# EAGLE design bootloader_example (EAGLE 5.10)
JAMECO: 100803, 4x100766
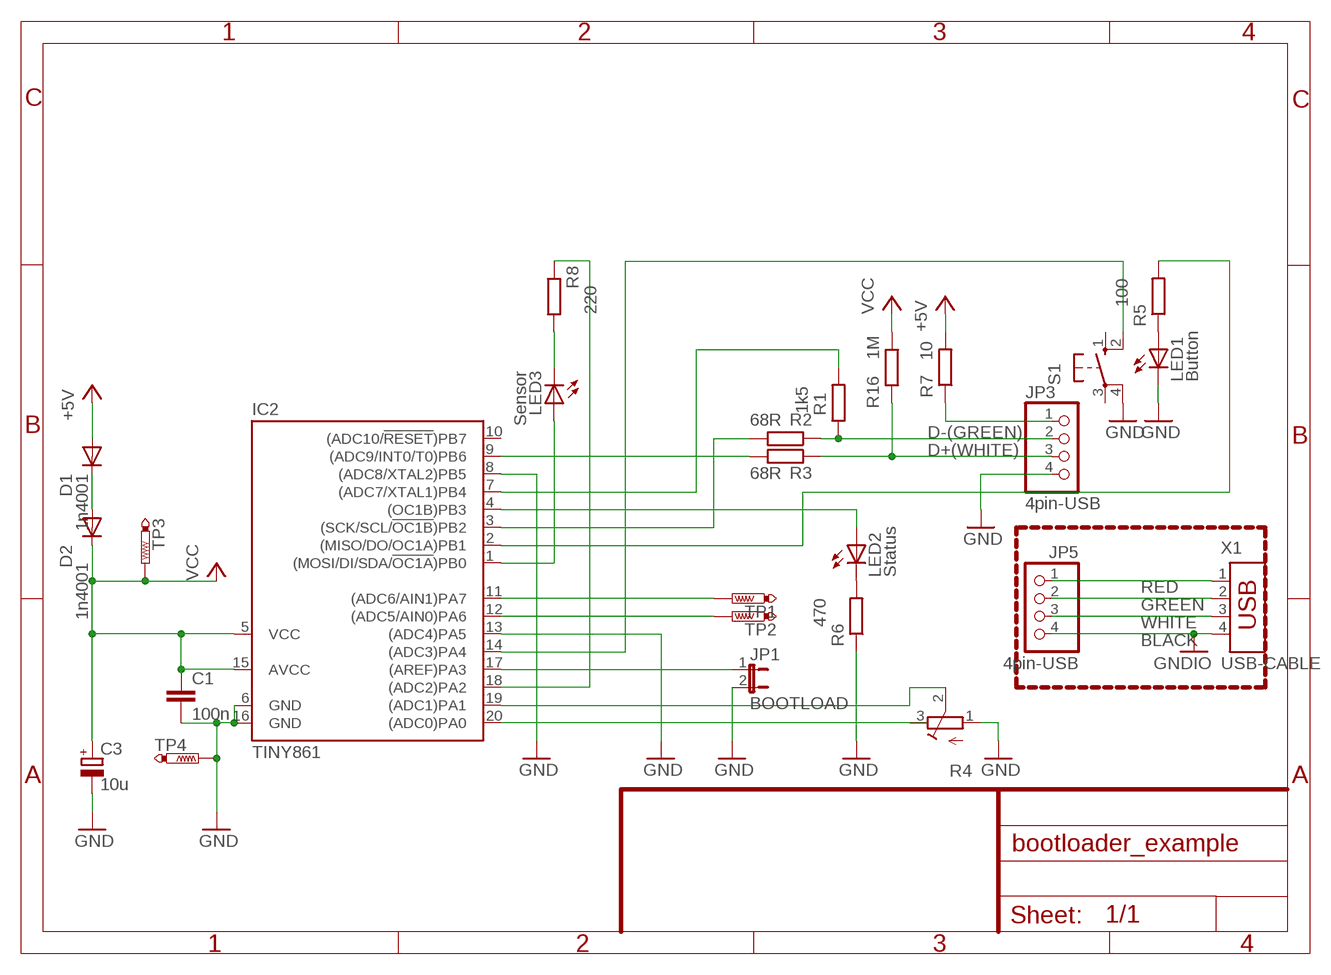
[diagram p0: schematic, sheet 1]

## Parts
C1  100n  C-EU050-030X075  [C050-030X075]
C3  10u  CPOL-EUE2.5-5  [E2,5-5]
D1  1n4001  1N4148DO35-7  [DO35-7]
D2  1n4001  1N4148DO35-7  [DO35-7]
IC2  TINY861  TINY26LP  [DIL20]
JP1  BOOTLOAD  JP1E  [JP1]
JP3  4pin-USB  PINHD-1X4  [1X04]
JP5  4pin-USB  PINHD-1X4  [1X04]
LED1  Button  LED3MM  [LED3MM]
LED2  Status  LED3MM  [LED3MM]
LED3  Sensor  LED3MM  [LED3MM]
R1  1k5  R-EU_0204/7  [0204/7]
R2  68R  R-EU_0207/2V  [0207/2V]
R3  68R  R-EU_0207/2V  [0207/2V]
R4  R-TRIMM64Y  [RTRIM64Y]
R5  100  R-EU_0207/10  [0207/10]
R6  470  R-EU_0204/5  [0204/5]
R7  10  R-EU_0207/2V  [0207/2V]
R8  220  R-EU_0204/2V  [0204V]
R16  1M  R-EU_0207/10  [0207/10]
S1  10-XX  [B3F-10XX]
TP1  PTR1PAD1-13  [P1-13]
TP2  PTR1PAD1-13  [P1-13]
TP3  PTR1PAD1-13  [P1-13]
TP4  PTR1PAD1-13  [P1-13]
X1  USB-CABLE  USB-787616  [USB]

## Nets
+4.4V: D1.C D2.A
+5V: D1.A R7.2
BLACK: JP5.4 X1.4 ; supply symbol labelled GNDIO
D+(WHITE): JP3.3 R3.1 R16.2
D-(GREEN): JP3.2 R1.1 R2.1
GND: C1.2 C3.- IC2.6(GND) IC2.8((ADC8/XTAL2)PB5) IC2.13((ADC4)PA5) IC2.16(GND) JP1.2 JP3.4 LED1.K(C) R4.1(E) R6.1 S1.4(P1) TP4.TP
GREEN: JP5.2 X1.2
N$1: IC2.19((ADC1)PA1) R4.2(S)
N$2: IC2.17((AREF)PA3) JP1.1
N$3: LED2.K(C) R6.2
N$4: IC2.4((OC1B)PB3) LED2.A
N$5: IC2.20((ADC0)PA0) R4.3(A)
N$6: IC2.14((ADC3)PA4) S1.2(S1)
N$7: LED1.A R5.1
N$8: IC2.2((MISO/DO/OC1A)PB1) R5.2
N$9: IC2.11((ADC6/AIN1)PA7) TP1.TP
N$10: IC2.12((ADC5/AIN0)PA6) TP2.TP
N$11: LED3.K(C) R8.2
N$12: IC2.1((MOSI/DI/SDA/!OC1A!)PB0) LED3.A
N$13: IC2.18((ADC2)PA2) R8.1
N$22: IC2.3((SCK/SCL/!OC1B!)PB2) R2.2
N$24: IC2.9((ADC9/INT0/T0)PB6) R3.2
N$28: IC2.7((ADC7/XTAL1)PB4) R1.2
RED: JP5.1 X1.1
USB_POW: JP3.1 R7.1
VCC: C1.1 C3.+ D2.C IC2.5(VCC) IC2.15(AVCC) R16.1 TP3.TP
WHITE: JP5.3 X1.3
Unconnected: IC2.10((ADC10/!RESET!)PB7) S1.1(S) S1.3(P)

## Library data of the parts
C1 = rcl:C-EU: CAPACITOR, European symbol
C3 = rcl:CPOL-EU: POLARIZED CAPACITOR, European symbol
D1 D2 = diode:1N4148: DIODE high speed (Philips)
IC2 = atmel:TINY26*: 8-bit AVR Microcontroller with 2K Bytes Flash Source: http://www.atmel.com .. doc1477.pdf
JP1 = jumper:JP1E: JUMPER
JP3 JP5 = pinhead:PINHD-1X4: PIN HEADER
LED1-LED3 = led:LED: LED OSRAM: - CHIPLED LG R971, LG N971, LY N971, LG Q971, LY Q971, LO R971, LY R971 LH N974, LH R974 LS Q976, LO Q976, LY Q976 LO Q996 - Hyper CHIPLED LW Q18S LB Q993, LB Q99A, LB R99A - SideLED LS A670, LO A670, LY A670, LG A670, LP A670 LB A673, LV A673, LT A673, LW A673 LH A674 LY A675 LS A676, LA A676, LO A676, LY A676, LW A676 LS A679, LY A679, LG A679 - Hyper Micro SIDELED® LS Y876, LA Y876, LO Y876, LY Y876 LT Y87S - SmartLED LW L88C, LW L88S LB L89C, LB L89S, LG L890 LS L89K, LO L89K, LY L89K LS L896, LA L896, LO L896, LY L896 - TOPLED LS T670, LO T670, LY T670, LG T670, LP T670 LSG T670, LSP T670, LSY T670, LOP T670, LYG T670 LG T671, LOG T671, LSG T671 LB T673, LV T673, LT T673, LW T673 LH T674 LS T676, LA T676, LO T676, LY T676, LB T676, LH T676, LSB T676, LW T676 LB T67C, LV T67C, LT T67C, LS T67K, LO T67K, LY T67K, LW E67C LS E67B, LA E67B, LO E67B, LY E67B, LB E67C, LV E67C, LT E67C LW T67C LS T679, LY T679, LG T679 LS T770, LO T770, LY T770, LG T770, LP T770 LB T773, LV T773, LT T773, LW T773 LH T774 LS E675, LA E675, LY E675, LS T675 LS T776, LA T776, LO T776, LY T776, LB T776 LHGB T686 LT T68C, LB T68C - Hyper Mini TOPLED® LB M676 - Mini TOPLED Santana® LG M470 LS M47K, LO M47K, LY M47K Source: http://www.osram.convergy.de - LUMILED® LXK2-PW12-R00, LXK2-PW12-S00, LXK2-PW14-U00, LXK2-PW14-V00 LXK2-PM12-R00, LXK2-PM12-S00, LXK2-PM14-U00 LXK2-PE12-Q00, LXK2-PE12-R00, LXK2-PE12-S00, LXK2-PE14-T00, LXK2-PE14-U00 LXK2-PB12-K00, LXK2-PB12-L00, LXK2-PB12-M00, LXK2-PB14-N00, LXK2-PB14-P00, LXK2-PB14-Q00 LXK2-PR12-L00, LXK2-PR12-M00, LXK2-PR14-Q00, LXK2-PR14-R00 LXK2-PD12-Q00, LXK2-PD12-R00, LXK2-PD12-S00 LXK2-PH12-R00, LXK2-PH12-S00 LXK2-PL12-P00, LXK2-PL12-Q00, LXK2-PL12-R00 Source: www.luxeon.com
R1-R3 R5-R8 R16 = rcl:R-EU_: RESISTOR, European symbol
R4 = rcl:R-TRIMM: Trimm resistor
S1 = switch-omron:10-XX: OMRON SWITCH
TP1-TP4 = testpad:PTR1: TEST PIN
X1 = con-amp:USB-787616: AMP connector

## Board
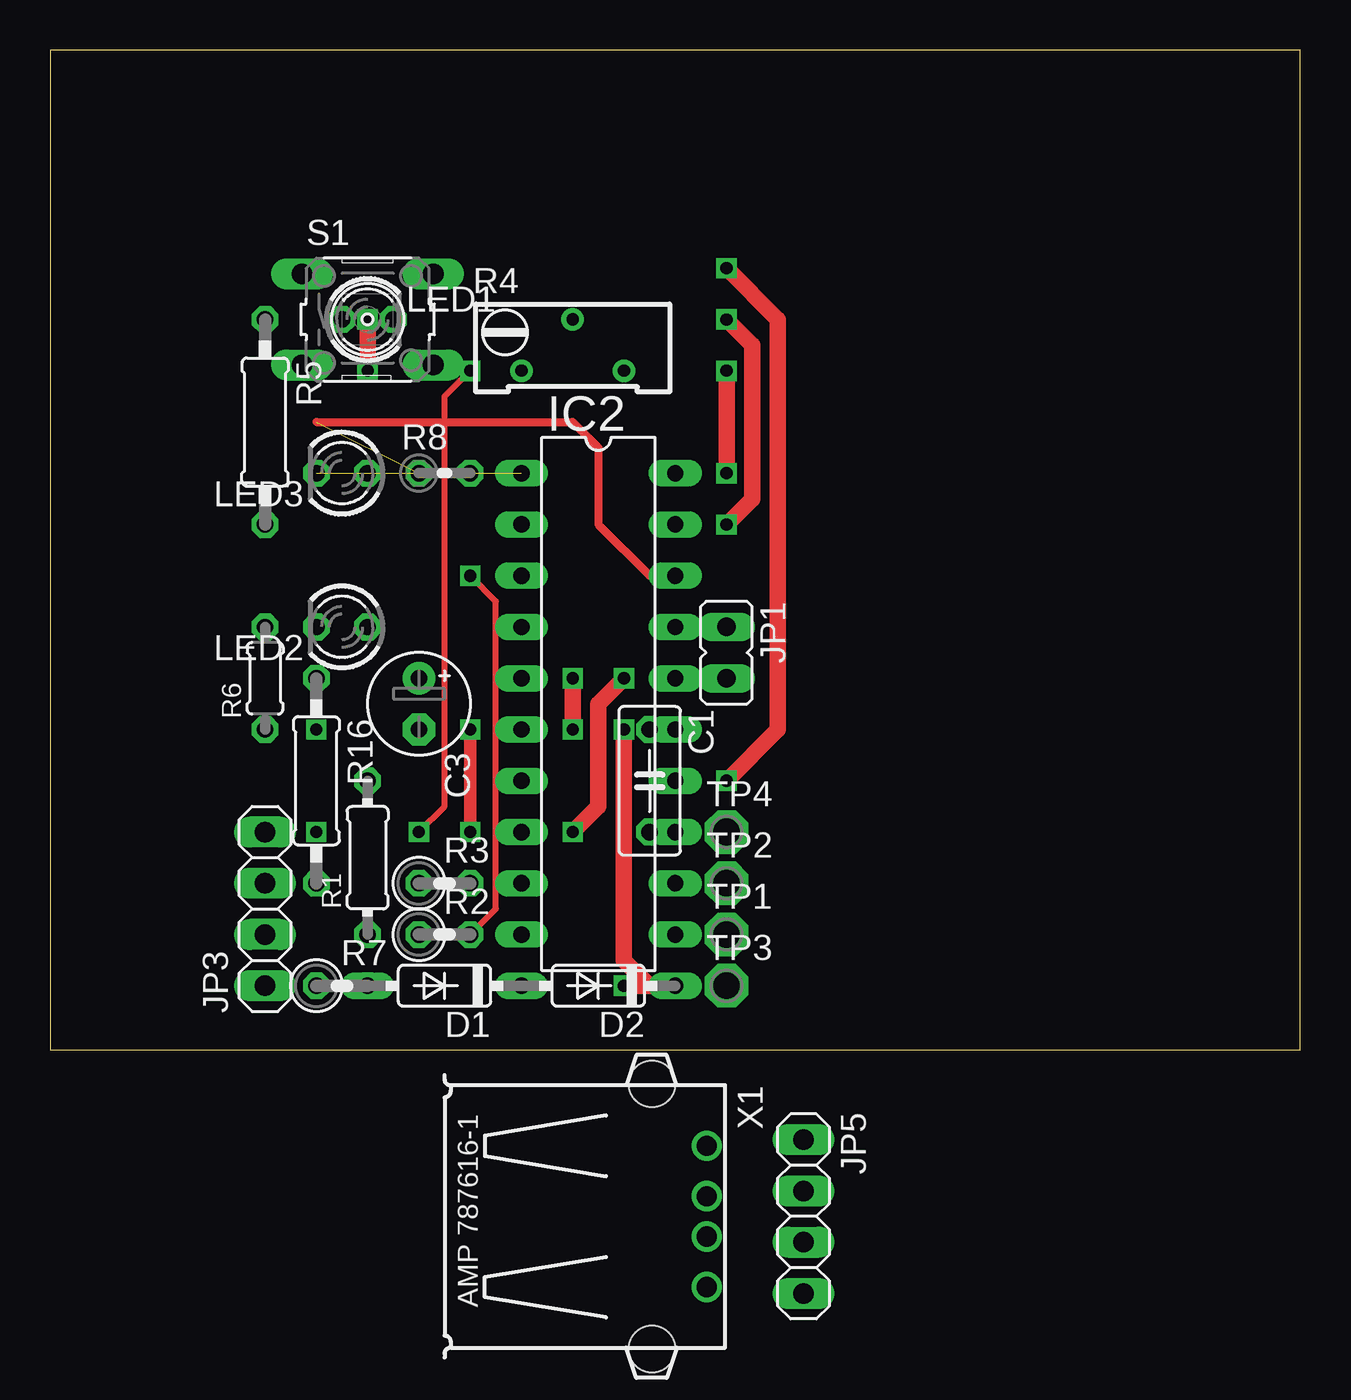
[diagram p1: board, top side]
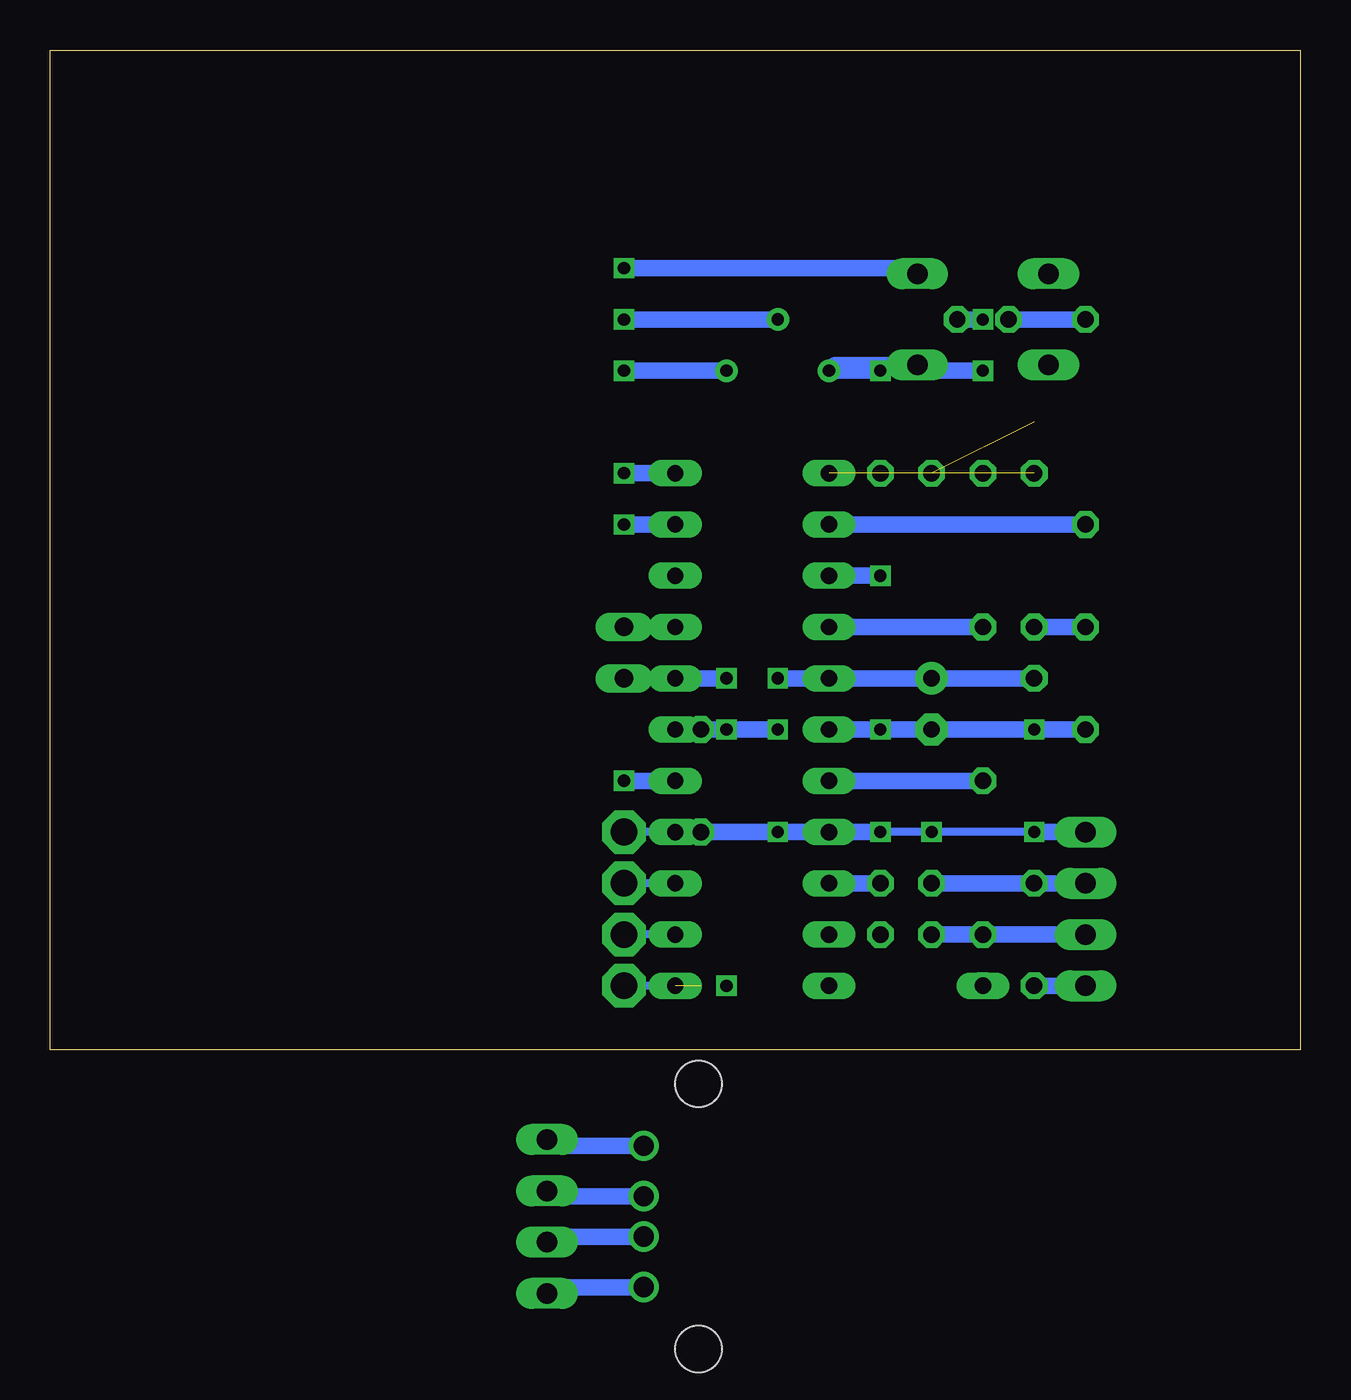
[diagram p2: board, bottom side, seen from below]

Size 61.9 x 49.52 mm. Coordinates in mm from the lower left corner, seen from the top.
Outline: 0,0 61.9,0 61.9,49.52 0,49.52 0,0
Copper layers (1*16): Top 0.035mm / dielectric 1.5mm / Bottom 0.035mm
Design rules "default *": minimum track width 20mil, minimum drill 12mil, track to track 8mil, track to pad 8mil, pad to pad 8mil, via to via 8mil, smd to smd 8mil, copper to edge 20mil, drill to drill 8mil, minimum pad ring 10mil, minimum via ring 8mil, stop-mask expansion 0mil, vias tented up to drill 0mil, thermal gap 10mil

### Footprints (pad centres in the part's own frame; a part is rotated, then mirrored left to right if it is on the bottom)
C050-030X075 = drill 0.813 octagon: 1 -2.54,0; 2 2.54,0
E2,5-5 = drill 0.813 pad 1.6 round: + -1.27,0 | drill 0.813 pad 1.6 octagon: - 1.27,0
DO35-7 = drill 0.813 long: A 3.81,0; C -3.81,0
DIL20 = drill 0.813 long: 1 -11.43,-3.81; 2 -8.89,-3.81; 3 -6.35,-3.81; 4 -3.81,-3.81; 5 -1.27,-3.81; 6 1.27,-3.81; 7 3.81,-3.81; 8 6.35,-3.81; 9 8.89,-3.81; 10 11.43,-3.81; 11 11.43,3.81; 12 8.89,3.81; 13 6.35,3.81; 14 3.81,3.81; 15 1.27,3.81; 16 -1.27,3.81; 17 -3.81,3.81; 18 -6.35,3.81; 19 -8.89,3.81; 20 -11.43,3.81
JP1 = drill 0.914 long: 1 0,-1.27; 2 0,1.27
1X04 = drill 1.016 long: 1 -3.81,0; 2 -1.27,0; 3 1.27,0; 4 3.81,0
LED3MM = drill 0.813 octagon: A -1.27,0; K 1.27,0
0204/7 = drill 0.813 octagon: 1 -3.81,0; 2 3.81,0
0207/2V = drill 0.813 octagon: 1 -1.27,0; 2 1.27,0
RTRIM64Y = drill 0.61 round: 1 0,-2.54; 2 -2.54,0; 3 0,2.54
0207/10 = drill 0.813 octagon: 1 -5.08,0; 2 5.08,0
0204/5 = drill 0.813 octagon: 1 -2.54,0; 2 2.54,0
0204V = drill 0.813 octagon: 1 -1.27,0; 2 1.27,0
B3F-10XX = drill 1.016 long: 1 -3.251,2.261; 2 3.251,2.261; 3 -3.251,-2.261; 4 3.251,-2.261
P1-13 = drill 1.321 pad 2.159 octagon: TP 0,0
USB = drill 1 round: 1 -3.5,12.99; 2 -1,12.99; 3 1,12.99; 4 3.5,12.99 | hole 2.3: -6.57,10.28; 6.57,10.28

### Placement (x,y rotation side)
C1  29.68,13.33 270 top
C3  18.25,17.14 270 top
D1  19.52,3.17 180 top
D2  27.14,3.17 180 top
IC2  27.14,17.14 270 top
JP1  33.49,19.68 180 top
JP3  10.63,6.98 90 top
JP5  37.3,-8.26 270 top  (outside the outline)
LED1  15.71,36.19 0 top
LED2  14.44,20.95 180 top
LED3  14.44,28.57 180 top
R1  15.71,9.52 90 top
R2  19.52,5.71 0 top
R3  19.52,8.25 0 top
R4  25.87,33.65 270 top
R5  10.63,31.11 270 top
R6  10.63,18.41 90 top
R7  14.44,3.17 0 top
R8  19.52,28.57 0 top
R16  13.17,13.33 270 top
S1  15.71,36.19 0 top
TP1  33.49,5.71 0 top
TP2  33.49,8.25 0 top
TP3  33.49,3.17 0 top
TP4  33.49,10.79 0 top
X1  19.52,-8.26 270 top

### Tracks (layer width: path | path; a pad name or v marks a point on that pad's centre or on a via)
BLACK
  Bottom 0.813: X1.4 37.3,-11.76 JP5.4
D+(WHITE)
  Bottom 0.813: R3.1 R16.2 JP3.3
D-(GREEN)
  Bottom 0.813: JP3.2 R1.1 R2.1
GND  (via drill 0.6)
  Top 0.305: v20.79,33.65 19.52,32.38 19.52,12.06 v18.25,10.79
  Top 0.61: v20.79,10.79 v20.79,15.87
  Top 0.813: v25.87,10.79 27.14,12.06 27.14,17.14 v28.41,18.41 | v15.71,33.65 v15.71,36.19
  Bottom 0.305: IC2.16 JP1.2
  Bottom 0.406: v13.17,10.79 v18.25,10.79 v20.79,10.79 | IC2.13 TP4.TP
  Bottom 0.813: v20.79,15.87 IC2.6 C3.- v13.17,15.87 R6.1 | C1.2 IC2.13 v25.87,10.79 IC2.8 v20.79,10.79 | JP3.4 v13.17,10.79 | v28.41,18.41 IC2.16 | 19.52,33.93 S1.4 | 19.52,33.93 23.05,33.93 R4.1 v20.79,33.65 | v15.71,36.19 LED1.K | v15.71,33.65 19.24,33.65 19.52,33.93
GREEN
  Bottom 0.813: X1.2 37.3,-7.26 JP5.2
N$1  (via drill 0.6)
  Top 0.813: v33.49,26.03 34.76,27.3 34.76,34.92 v33.49,36.19
  Bottom 0.813: IC2.19 v33.49,26.03 | v33.49,36.19 R4.2
N$2
  Bottom 0.305: IC2.17 JP1.1
N$3
  Bottom 0.813: R6.2 LED2.K
N$4
  Bottom 0.813: LED2.A IC2.4
N$5  (via drill 0.6)
  Top 0.813: v33.49,28.57 v33.49,33.65
  Bottom 0.813: v33.49,33.65 R4.3 | IC2.20 v33.49,28.57
N$6  (via drill 0.6)
  Top 0.813: v33.49,13.33 36.03,15.87 36.03,36.19 v33.49,38.73
  Bottom 0.813: IC2.14 v33.49,13.33 | v33.49,38.73 19.24,38.73 S1.2
N$7
  Bottom 0.813: R5.1 LED1.A
N$8
  Bottom 0.813: R5.2 IC2.2
N$9
  Bottom 0.406: IC2.11 TP1.TP
N$10
  Bottom 0.406: IC2.12 TP2.TP
N$11  (1 unrouted)
N$12  (1 unrouted)
N$13  (1 unrouted)
  Top 0.406: IC2.18 29.68,23.49 27.14,26.03 27.14,29.84 25.87,31.11 13.17,31.11
N$22  (via drill 0.6)
  Top 0.305: R2.2 22.06,6.98 22.06,22.22 v20.79,23.49
  Bottom 0.813: v20.79,23.49 IC2.3
N$24
  Bottom 0.813: R3.2 IC2.9
N$28
  Bottom 0.813: R1.2 IC2.7
RED
  Bottom 0.813: X1.1 37.3,-4.76 JP5.1
USB_POW
  Bottom 0.813: JP3.1 R7.1
VCC  (via drill 0.6)  (1 unrouted)
  Top 0.813: v25.87,18.41 v25.87,15.87 | v28.41,3.17 29.68,3.17 28.41,4.44 v28.41,15.87
  Bottom 0.406: D2.C TP3.TP
  Bottom 0.813: R16.1 C3.+ IC2.5 v25.87,18.41 | C1.1 IC2.15 v28.41,15.87 v25.87,15.87
  other vias: 30.95,3.17
WHITE
  Bottom 0.813: X1.3 37.3,-9.26 JP5.3